# Altium project PWB.PrjPcb (part 3 of 3)

## Sheet RD.SchDoc
size A4; SheetNumber: 10; SheetTotal: 10
Used 12 times, as channels Designator, Designator, Designator, Designator, Designator, Designator, Designator, Designator, Designator, Designator, Designator, Designator. Parts and nets are listed once, with the designators drawn on the sheet.
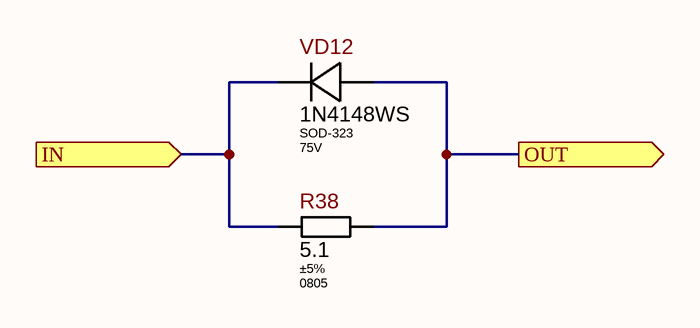
[diagram p9: RD.SchDoc]

### Parts
R38  Tolerance: ±5%  Package: 0805  [R_ANY_CHIP_0805_MED]  (hidden comment: 5.1)
VD12  Package: SOD-323  Voltage: 75V  [SOD-323_MED]  (hidden comment: 1N4148WS)

### Ports
IN (in), OUT (out)

### Nets
IN: R38.1 VD12.CA ; port IN
OUT: R38.2 VD12.AN ; port OUT

### Channels
Designator: designators end in A; ports IN=NetIC2_6 OUT=NetR38A_2
Designator: designators end in B; ports IN=NetIC2_6 OUT=NetR38B_2
Designator: designators end in C; ports IN=NetIC2_6 OUT=NetR38C_2
Designator: designators end in D; ports IN=NetIC3_6 OUT=NetR38D_2
Designator: designators end in E; ports IN=NetIC3_6 OUT=NetR38E_2
Designator: designators end in F; ports IN=NetIC3_6 OUT=NetR38F_2
Designator: designators end in G; ports IN=NetIC4_6 OUT=NetR38G_2
Designator: designators end in H; ports IN=NetIC4_6 OUT=NetR38H_2
Designator: designators end in I; ports IN=NetIC4_6 OUT=NetR38I_2
Designator: designators end in J; ports IN=NetIC5_6 OUT=NetR38J_2
Designator: designators end in K; ports IN=NetIC5_6 OUT=NetR38K_2
Designator: designators end in L; ports IN=NetIC5_6 OUT=NetR38L_2

### Notes on the sheet
- Title
- Product:
- Project:
- Size:
- Date:
- Variant:
- A4
- Authors:
- Time:
- Sheet
- of
- Revision:
- @Vitech_ua
- Commit:

### Library data of the parts
R38 = RC0805JR-075R1L: 5.1 Ohms ±5%, 1/8W 0805 Thick Film Resistor; Manufacturer: Yageo; Ajax_1C_ID: 8977; Ajax_1C_PN: 5.1R 5% 0805 Resistors SMD RoHS; Ajax_1С_Status: Mass Production; Power Rating: 0.125W; Voltage: 150V; Component Status: Released; Temperature Stability: ±200ppm/°C; Replacement: NONE; GUID_1C: 24a2388c-8944-11e6-822a-d8cb8a9acc66; Value: 5.1; Part Number: RC0805JR-075R1L; Component Type: SMD; Part Type: Thick Film; Temperature Range: -55°C ~ 155°C; ComponentLink1URL: https://eu.mouser.com/datasheet/2/447/PYu_RC_Group_51_RoHS_L_11-1984063.pdf; Supplier 1: Digi-Key; Supplier Part Number 1: 311-5.1ARTR-ND; Price: 0,0011; ComponentLink1Description: Datasheet
VD12 = 1N4148WS: Diode Standard 75V 150mA, SOD-323F; Manufacturer: Diodec Semiconductor; Ajax_1C_ID: 10255; Ajax_1C_PN: 1N4148WS diotec SOD-323; Ajax_1С_Status: Mass Production; Marking: W2; Component Status: Released; Standard Lead Time: NONE; Vf: 1V @ 50mA; Replacement: 1N4148WS-E; GUID_1C: 3d8ac204-519f-11e7-8106-14dda9d2d04d; Part Type: Fast Switching; Component Type: SMD; Current: 150mA; Temperature Range: -55°C ~ 150°C; ComponentLink1URL: https://diotec.com/tl_files/diotec/files/pdf/datasheets/1n4148ws.pdf; Supplier 1: TME; Supplier Part Number 1: 1N4148WS-DIO; Price: 0,00864; ComponentLink1Description: Datasheet; Part Number: 1N4148WS

## Nets that join several sheets
3V3: PWB (5 pins), STEP_DOWN (C4A.1 C5A.1 HG1A.AN L1A.2), EXT_U_DET (R55.1), OCP (10 pins)
5V: PWB (R8.2 TP5.1), STEP_DOWN (C4B.1 C5B.1 HG1B.AN L1B.2), EG8010 (14 pins), GATE_DRIVER (6 pins)
12V: PWB (C2.1 R62.1 TP4.1 VT2.3), STEP_DOWN (C3A.1 C11A.1 D1A.3), STEP_DOWN (C3B.1 C11B.1 D1B.3), GATE_DRIVER (11 pins)
+V_BRIDGE: PWB (11 pins), REVERSE_POLARITY_PROT (VT19.2 VT21.2 VT23.2 VT25.2), Designator (K1A.1 VD9A.CA), Designator (K1B.1 VD9B.CA)
+VBAT: PWB (F1.2 K2.5 TP7.1 X8.1), REVERSE_POLARITY_PROT (VT18.2 VT20.2 VT22.2 VT24.2)
GND: PWB (31 pins), STEP_DOWN (7 pins), STEP_DOWN (7 pins), EG8010 (23 pins), EG/OC (VT1A.2), EG/OC (VT1B.2), EG/OC (VT1C.2), EG/OC (VT1D.2), EG/OC (VT1E.2), GATE_DRIVER (17 pins), GATE_DRIVER/OC (VT1F.2), REVERSE_POL_PROT/OC (VT1G.2), EXT_U_DET (VD8.3), OCP (11 pins), OCP/OC (VT1H.2), OCP/OC (VT1I.2), OC (VT1J.2), Designator/OC (VT1K.2), Designator/OC (VT1L.2)
cCONNECT_CHARGER: PWB (X3.23), OC (VT1J.1)
cEN_220V_OUT: PWB (X3.4), Designator/OC (VT1K.1)
cEN_BRIDGE_POWER: PWB (X3.22), REVERSE_POL_PROT/OC (VT1G.1)
cEN_BYPASS: PWB (X3.1), Designator/OC (VT1L.1)
cEN_UART_EG: PWB (X3.19), EG/OC (VT1E.1)
cPOWER_EN: PWB (X3.12), OCP (R32.2)
cPOWER_STROB: PWB (X3.11), OCP (R33.2)
dEXT_U_DET: PWB (X3.2), EXT_U_DET (R55.2 VD8.4)
dPOWER_STATE: PWB (X3.6), OCP (R59.2)
DT0: PWB (X3.14), EG/OC (VT1A.1)
DT0_CTRL: EG8010 (IC1.2 R9.1), EG/OC (VT1A.3)
DT1: PWB (X3.13), EG/OC (VT1B.1)
DT1_CTRL: EG8010 (IC1.1 R12.1), EG/OC (VT1B.3)
EG_RX: PWB (X3.17), EG8010 (DD1.2)
EG_TX: PWB (X3.18), EG8010 (DD2.4)
EN_PWM: PWB (TP10.1 VD2.AN VD3.AN), EG8010 (IC1.6), GATE_DRIVER (R14.2), GATE_DRIVER/OC (VT1F.1)
EN_PWM_OCP: PWB (TP12.1 VD3.CA), OCP (R17.2), OCP/OC (VT1H.3)
EN_UART: EG8010 (DD1.1 DD2.1 R13.1), EG/OC (VT1E.3)
EXT_AC_L: PWB (X7.2), EXT_U_DET (R56.1), Designator (K1B.7 K1B.8)
FQSEL: PWB (X3.8), EG/OC (VT1D.1)
FRQ_SEL: EG8010 (IC1.18 R11.1), EG/OC (VT1D.3)
NetC22_2: PWB (8 pins), GATE_DRIVER (C22.2 IC2.5)
NetC25_2: PWB (8 pins), GATE_DRIVER (C25.2 IC4.5)
NetD1A_4: PWB (R5.1), STEP_DOWN (D1A.4 R6A.1)
NetD1A_5: PWB (R62.2 R63.1), STEP_DOWN (D1A.5), STEP_DOWN (D1B.5)
NetD1B_4: PWB (R8.1), STEP_DOWN (D1B.4 R6B.1)
NetDD3_4: EG8010 (IC1.29), GATE_DRIVER (DD3.4)
NetDD3_7: EG8010 (IC1.30), GATE_DRIVER (DD3.7)
NetDD3_9: EG8010 (IC1.27), GATE_DRIVER (DD3.9)
NetDD3_12: EG8010 (IC1.28), GATE_DRIVER (DD3.12)
NetDD3_15: GATE_DRIVER (DD3.15 R58.1 TP15.1), GATE_DRIVER/OC (VT1F.3)
NetDD4_4: OCP (DD4.4 R59.1), OCP/OC (VT1H.1), OCP/OC (VT1I.1)
NetHG3_CA: OCP (HG3.CA), OCP/OC (VT1I.3)
NetIC2_6: PWB (R41.2), GATE_DRIVER (IC2.6 IC2.7), Designator (R38A.1 VD12A.CA), Designator (R38B.1 VD12B.CA), Designator (R38C.1 VD12C.CA)
NetIC3_6: PWB (R51.2), GATE_DRIVER (IC3.6 IC3.7), Designator (R38D.1 VD12D.CA), Designator (R38E.1 VD12E.CA), Designator (R38F.1 VD12F.CA)
NetIC4_6: PWB (R37.2), GATE_DRIVER (IC4.6 IC4.7), Designator (R38G.1 VD12G.CA), Designator (R38H.1 VD12H.CA), Designator (R38I.1 VD12I.CA)
NetIC5_6: PWB (R52.2), GATE_DRIVER (IC5.6 IC5.7), Designator (R38J.1 VD12J.CA), Designator (R38K.1 VD12K.CA), Designator (R38L.1 VD12L.CA)
NetK1A_2: Designator (K1A.2 VD9A.AN), Designator/OC (VT1K.3)
NetK1A_5: PWB (X4.2), Designator (K1A.5 K1A.6), Designator (K1B.5 K1B.6)
NetK1B_2: Designator (K1B.2 VD9B.AN), Designator/OC (VT1L.3)
NetK2_2: PWB (K2.2 VD14.AN), OC (VT1J.3)
NetR38A_2: PWB (VT9.1), Designator (R38A.2 VD12A.AN)
NetR38B_2: PWB (VT8.1), Designator (R38B.2 VD12B.AN)
NetR38C_2: PWB (VT7.1), Designator (R38C.2 VD12C.AN)
NetR38D_2: PWB (VT11.1), Designator (R38D.2 VD12D.AN)
NetR38E_2: PWB (VT14.1), Designator (R38E.2 VD12E.AN)
NetR38F_2: PWB (VT16.1), Designator (R38F.2 VD12F.AN)
NetR38G_2: PWB (VT6.1), Designator (R38G.2 VD12G.AN)
NetR38H_2: PWB (VT10.1), Designator (R38H.2 VD12H.AN)
NetR38I_2: PWB (VT13.1), Designator (R38I.2 VD12I.AN)
NetR38J_2: PWB (VT17.1), Designator (R38J.2 VD12J.AN)
NetR38K_2: PWB (VT15.1), Designator (R38K.2 VD12K.AN)
NetR38L_2: PWB (VT12.1), Designator (R38L.2 VD12L.AN)
NetR42_1: REVERSE_POLARITY_PROT (9 pins), REVERSE_POL_PROT/OC (VT1G.3)
NEUTRAL: PWB (C14.2 X4.1 X7.1 X12.1), EG8010 (VD1.2), EXT_U_DET (VD7.2)
SST: PWB (X3.5), EG/OC (VT1C.1)
SST_CTRL: EG8010 (IC1.21 R10.1), EG/OC (VT1C.3)
TR_OUT_L: PWB (C14.1 X12.2), EG8010 (VD1.1), Designator (K1A.7 K1A.8)
xMEAS_CURRENT: PWB (C18.1 R43.2 X3.20), OCP (R18.2)